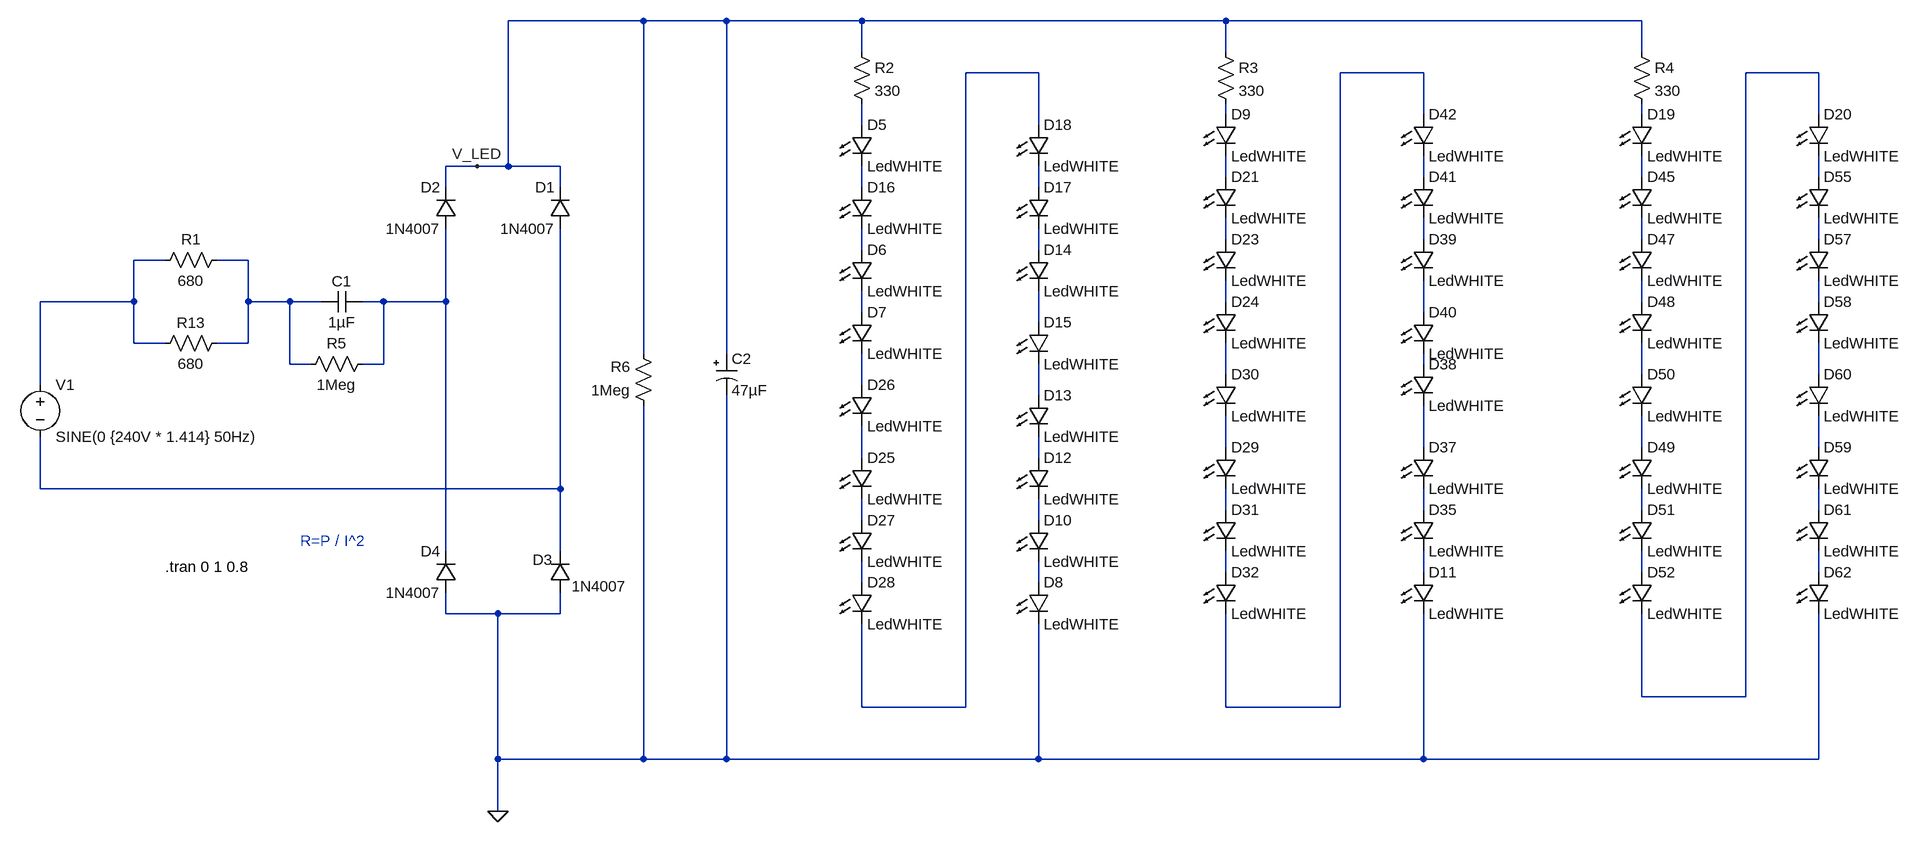
[diagram p0: schematic Led_mains_4.asc]
Led_mains_4.asc, the LTspice schematic file:
Version 4
SHEET 1 2404 804
WIRE 448 -432 240 -432
WIRE 576 -432 448 -432
WIRE 784 -432 576 -432
WIRE 1344 -432 784 -432
WIRE 1984 -432 1344 -432
WIRE 784 -384 784 -432
WIRE 1344 -384 1344 -432
WIRE 1984 -384 1984 -432
WIRE 1056 -352 944 -352
WIRE 1648 -352 1520 -352
WIRE 2256 -352 2144 -352
WIRE 1344 -288 1344 -304
WIRE 1648 -288 1648 -352
WIRE 1984 -288 1984 -304
WIRE 2256 -288 2256 -352
WIRE 784 -272 784 -304
WIRE 1056 -272 1056 -352
WIRE 192 -208 144 -208
WIRE 240 -208 240 -432
WIRE 240 -208 192 -208
WIRE 320 -208 240 -208
WIRE 1344 -192 1344 -224
WIRE 1648 -192 1648 -224
WIRE 1984 -192 1984 -224
WIRE 2256 -192 2256 -224
WIRE 144 -176 144 -208
WIRE 320 -176 320 -208
WIRE 784 -176 784 -208
WIRE 1056 -176 1056 -208
WIRE 1344 -96 1344 -128
WIRE 1648 -96 1648 -128
WIRE 1984 -96 1984 -128
WIRE 2256 -96 2256 -128
WIRE 784 -80 784 -112
WIRE 1056 -80 1056 -112
WIRE -288 -64 -336 -64
WIRE -160 -64 -208 -64
WIRE -336 0 -336 -64
WIRE -336 0 -480 0
WIRE -160 0 -160 -64
WIRE -96 0 -160 0
WIRE -48 0 -96 0
WIRE 48 0 16 0
WIRE 144 0 144 -112
WIRE 144 0 48 0
WIRE 1344 0 1344 -32
WIRE 1984 0 1984 -32
WIRE 2256 0 2256 -32
WIRE 784 16 784 -16
WIRE 1648 16 1648 -32
WIRE 1056 32 1056 -16
WIRE -336 64 -336 0
WIRE -288 64 -336 64
WIRE -160 64 -160 0
WIRE -160 64 -208 64
WIRE 448 80 448 -432
WIRE 576 80 576 -432
WIRE -96 96 -96 0
WIRE -64 96 -96 96
WIRE 48 96 48 0
WIRE 48 96 16 96
WIRE 1648 96 1648 80
WIRE 1344 112 1344 64
WIRE 1984 112 1984 64
WIRE 2256 112 2256 64
WIRE -480 128 -480 0
WIRE 784 128 784 80
WIRE 1056 144 1056 96
WIRE 1344 224 1344 176
WIRE 1648 224 1648 160
WIRE 1984 224 1984 176
WIRE 2256 224 2256 176
WIRE 784 240 784 192
WIRE 1056 240 1056 208
WIRE -480 288 -480 208
WIRE 320 288 320 -112
WIRE 320 288 -480 288
WIRE 1344 320 1344 288
WIRE 1648 320 1648 288
WIRE 1984 320 1984 288
WIRE 2256 320 2256 288
WIRE 784 336 784 304
WIRE 1056 336 1056 304
WIRE 144 384 144 0
WIRE 320 384 320 288
WIRE 1344 416 1344 384
WIRE 1648 416 1648 384
WIRE 1984 416 1984 384
WIRE 2256 416 2256 384
WIRE 784 432 784 400
WIRE 1056 432 1056 400
WIRE 144 480 144 448
WIRE 224 480 144 480
WIRE 320 480 320 448
WIRE 320 480 224 480
WIRE 1984 608 1984 480
WIRE 2144 608 2144 -352
WIRE 2144 608 1984 608
WIRE 784 624 784 496
WIRE 944 624 944 -352
WIRE 944 624 784 624
WIRE 1344 624 1344 480
WIRE 1520 624 1520 -352
WIRE 1520 624 1344 624
WIRE 224 704 224 480
WIRE 448 704 448 160
WIRE 448 704 224 704
WIRE 576 704 576 144
WIRE 576 704 448 704
WIRE 1056 704 1056 496
WIRE 1056 704 576 704
WIRE 1648 704 1648 480
WIRE 1648 704 1056 704
WIRE 2256 704 2256 480
WIRE 2256 704 1648 704
WIRE 224 784 224 704
FLAG 224 784 0
FLAG 192 -208 V_LED
SYMBOL diode 336 -112 R180
WINDOW 0 24 64 Left 2
WINDOW 3 24 0 Left 2
SYMATTR InstName D1
SYMATTR Value 1N4007
SYMBOL diode 160 -112 R180
WINDOW 0 24 64 Left 2
WINDOW 3 24 0 Left 2
SYMATTR InstName D2
SYMATTR Value 1N4007
SYMBOL diode 336 448 R180
WINDOW 0 28 51 Left 2
WINDOW 3 -86 10 Left 2
SYMATTR InstName D3
SYMATTR Value 1N4007
SYMBOL diode 160 448 R180
WINDOW 0 24 64 Left 2
WINDOW 3 24 0 Left 2
SYMATTR InstName D4
SYMATTR Value 1N4007
SYMBOL voltage -480 112 R0
WINDOW 123 0 0 Left 2
WINDOW 39 0 0 Left 2
SYMATTR InstName V1
SYMATTR Value SINE(0 {240V * 1.414} 50Hz)
SYMBOL LED 768 -176 R0
SYMATTR InstName D16
SYMATTR Value LedWHITE
SYMBOL LED 768 -80 R0
SYMATTR InstName D6
SYMATTR Value LedWHITE
SYMBOL LED 768 16 R0
SYMATTR InstName D7
SYMATTR Value LedWHITE
SYMBOL LED 768 240 R0
SYMATTR InstName D25
SYMATTR Value LedWHITE
SYMBOL LED 768 128 R0
SYMATTR InstName D26
SYMATTR Value LedWHITE
SYMBOL LED 768 336 R0
SYMATTR InstName D27
SYMATTR Value LedWHITE
SYMBOL LED 768 432 R0
SYMATTR InstName D28
SYMATTR Value LedWHITE
SYMBOL cap 16 -16 R90
WINDOW 0 0 32 VBottom 2
WINDOW 3 32 32 VTop 2
SYMATTR InstName C1
SYMATTR Value 1µF
SYMATTR SpiceLine V=400
SYMBOL LED 1040 336 R0
SYMATTR InstName D10
SYMATTR Value LedWHITE
SYMBOL LED 1040 240 R0
SYMATTR InstName D12
SYMATTR Value LedWHITE
SYMBOL LED 1040 144 R0
SYMATTR InstName D13
SYMATTR Value LedWHITE
SYMBOL LED 1040 -80 R0
SYMATTR InstName D14
SYMATTR Value LedWHITE
SYMBOL LED 1040 32 R0
SYMATTR InstName D15
SYMATTR Value LedWHITE
SYMBOL LED 1040 -176 R0
SYMATTR InstName D17
SYMATTR Value LedWHITE
SYMBOL LED 1040 -272 R0
SYMATTR InstName D18
SYMATTR Value LedWHITE
SYMBOL LED 1328 -192 R0
SYMATTR InstName D21
SYMATTR Value LedWHITE
SYMBOL LED 1328 -96 R0
SYMATTR InstName D23
SYMATTR Value LedWHITE
SYMBOL LED 1328 0 R0
SYMATTR InstName D24
SYMATTR Value LedWHITE
SYMBOL LED 1328 224 R0
SYMATTR InstName D29
SYMATTR Value LedWHITE
SYMBOL LED 1328 112 R0
SYMATTR InstName D30
SYMATTR Value LedWHITE
SYMBOL LED 1328 320 R0
SYMATTR InstName D31
SYMATTR Value LedWHITE
SYMBOL LED 1328 416 R0
SYMATTR InstName D32
SYMATTR Value LedWHITE
SYMBOL LED 1632 320 R0
SYMATTR InstName D35
SYMATTR Value LedWHITE
SYMBOL LED 1632 224 R0
SYMATTR InstName D37
SYMATTR Value LedWHITE
SYMBOL LED 1632 96 R0
SYMATTR InstName D38
SYMATTR Value LedWHITE
SYMBOL LED 1632 -96 R0
SYMATTR InstName D39
SYMATTR Value LedWHITE
SYMBOL LED 1632 16 R0
SYMATTR InstName D40
SYMATTR Value LedWHITE
SYMBOL LED 1632 -192 R0
SYMATTR InstName D41
SYMATTR Value LedWHITE
SYMBOL LED 1632 -288 R0
SYMATTR InstName D42
SYMATTR Value LedWHITE
SYMBOL LED 1968 -192 R0
SYMATTR InstName D45
SYMATTR Value LedWHITE
SYMBOL LED 1968 -96 R0
SYMATTR InstName D47
SYMATTR Value LedWHITE
SYMBOL LED 1968 0 R0
SYMATTR InstName D48
SYMATTR Value LedWHITE
SYMBOL LED 1968 224 R0
SYMATTR InstName D49
SYMATTR Value LedWHITE
SYMBOL LED 1968 112 R0
SYMATTR InstName D50
SYMATTR Value LedWHITE
SYMBOL LED 1968 320 R0
SYMATTR InstName D51
SYMATTR Value LedWHITE
SYMBOL LED 1968 416 R0
SYMATTR InstName D52
SYMATTR Value LedWHITE
SYMBOL LED 2240 -192 R0
SYMATTR InstName D55
SYMATTR Value LedWHITE
SYMBOL LED 2240 -96 R0
SYMATTR InstName D57
SYMATTR Value LedWHITE
SYMBOL LED 2240 0 R0
SYMATTR InstName D58
SYMATTR Value LedWHITE
SYMBOL LED 2240 224 R0
SYMATTR InstName D59
SYMATTR Value LedWHITE
SYMBOL LED 2240 112 R0
SYMATTR InstName D60
SYMATTR Value LedWHITE
SYMBOL LED 2240 320 R0
SYMATTR InstName D61
SYMATTR Value LedWHITE
SYMBOL LED 2240 416 R0
SYMATTR InstName D62
SYMATTR Value LedWHITE
SYMBOL LED 768 -272 R0
SYMATTR InstName D5
SYMATTR Value LedWHITE
SYMBOL LED 1040 432 R0
SYMATTR InstName D8
SYMATTR Value LedWHITE
SYMBOL LED 1328 -288 R0
SYMATTR InstName D9
SYMATTR Value LedWHITE
SYMBOL LED 1632 416 R0
SYMATTR InstName D11
SYMATTR Value LedWHITE
SYMBOL LED 1968 -288 R0
SYMATTR InstName D19
SYMATTR Value LedWHITE
SYMBOL LED 2240 -288 R0
SYMATTR InstName D20
SYMATTR Value LedWHITE
SYMBOL res 768 -400 R0
SYMATTR InstName R2
SYMATTR Value 330
SYMBOL res 1328 -400 R0
SYMATTR InstName R3
SYMATTR Value 330
SYMBOL res 1968 -400 R0
SYMATTR InstName R4
SYMATTR Value 330
SYMBOL polcap 560 80 R0
SYMATTR InstName C2
SYMATTR Value 47µF
SYMATTR SpiceLine V=100
SYMBOL res 32 80 R90
WINDOW 0 0 56 VBottom 2
WINDOW 3 32 56 VTop 2
SYMATTR InstName R5
SYMATTR Value 1Meg
SYMBOL res 464 176 R180
WINDOW 0 36 76 Left 2
WINDOW 3 36 40 Left 2
SYMATTR InstName R6
SYMATTR Value 1Meg
SYMBOL res -192 48 R90
WINDOW 0 0 56 VBottom 2
WINDOW 3 32 56 VTop 2
SYMATTR InstName R13
SYMATTR Value 680
SYMATTR SpiceLine tol=1 pwr=2
SYMBOL res -192 -80 R90
WINDOW 0 0 56 VBottom 2
WINDOW 3 32 56 VTop 2
SYMATTR InstName R1
SYMATTR Value 680
SYMATTR SpiceLine tol=1 pwr=2
TEXT -288 408 Left 2 !.tran 0 1 0.8
TEXT -80 368 Left 2 ;R=P / I^2

The netlist it stands for:
* Led_mains_4.asc
D1 N040 V_LED 1N4007
D2 N021 V_LED 1N4007
D3 0 N040 1N4007
D4 0 N021 1N4007
V1 N019 N040 SINE(0 {240V * 1.414} 50Hz)
D16 N011 N017 LedWHITE
D6 N017 N025 LedWHITE
D7 N025 N032 LedWHITE
D25 N038 N045 LedWHITE
D26 N032 N038 LedWHITE
D27 N045 N051 LedWHITE
D28 N051 N001 LedWHITE
C1 N021 N020 1µF V=400
D10 N046 N052 LedWHITE
D12 N039 N046 LedWHITE
D13 N033 N039 LedWHITE
D14 N018 N027 LedWHITE
D15 N027 N033 LedWHITE
D17 N012 N018 LedWHITE
D18 N001 N012 LedWHITE
D21 N007 N013 LedWHITE
D23 N013 N022 LedWHITE
D24 N022 N029 LedWHITE
D29 N034 N041 LedWHITE
D30 N029 N034 LedWHITE
D31 N041 N047 LedWHITE
D32 N047 N002 LedWHITE
D35 N042 N048 LedWHITE
D37 N035 N042 LedWHITE
D38 N028 N035 LedWHITE
D39 N014 N026 LedWHITE
D40 N026 N028 LedWHITE
D41 N008 N014 LedWHITE
D42 N002 N008 LedWHITE
D45 N009 N015 LedWHITE
D47 N015 N023 LedWHITE
D48 N023 N030 LedWHITE
D49 N036 N043 LedWHITE
D50 N030 N036 LedWHITE
D51 N043 N049 LedWHITE
D52 N049 N003 LedWHITE
D55 N010 N016 LedWHITE
D57 N016 N024 LedWHITE
D58 N024 N031 LedWHITE
D59 N037 N044 LedWHITE
D60 N031 N037 LedWHITE
D61 N044 N050 LedWHITE
D62 N050 0 LedWHITE
D5 N006 N011 LedWHITE
D8 N052 0 LedWHITE
D9 N004 N007 LedWHITE
D11 N048 0 LedWHITE
D19 N005 N009 LedWHITE
D20 N003 N010 LedWHITE
R2 V_LED N006 330
R3 V_LED N004 330
R4 V_LED N005 330
C2 V_LED 0 47µF V=100
R5 N021 N020 1Meg
R6 0 V_LED 1Meg
R13 N020 N019 680 tol=1 pwr=2
R1 N020 N019 680 tol=1 pwr=2
.model D D
.lib standard.dio
.tran 0 1 0.8
* R=P / I^2
.backanno
.end